# Altium schematic sheet COMS0004_2_TXDevMux.SchDoc: BLUEsat Switching Circuit
size A3; Engineer: D. JEDRYCHOWSKI; Organization: BLUEsat Project; Address1: Room 419; Address2: School of EE&T; Address3: UNSW, NSW 2052; Address4: Australia; DocumentNumber: COMS0004; SheetNumber: 2; SheetTotal: 4; Description: Selects the AFSK and GMSK modems for transmission; Version: 1.0
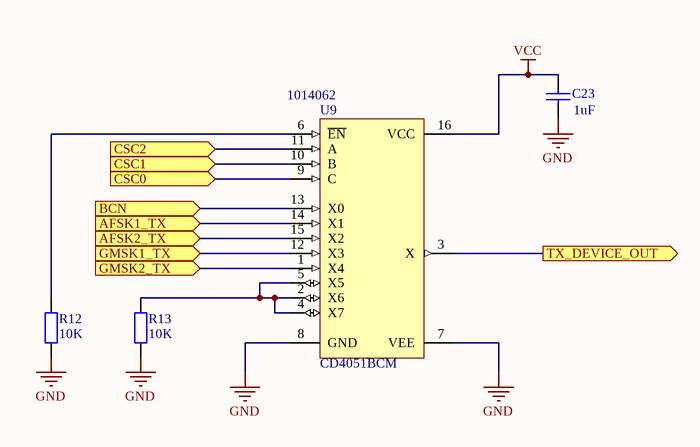
[diagram p0: COMS0004_2_TXDevMux.SchDoc]

## Parts
C23  value 1uF  [0805]  (hidden comment: C1210)
R12  value 10K  [RESC2012N]  (hidden comment: Res1)
R13  value 10K  [RESC2012N]  (hidden comment: Res1)
U9  CD4051BCM  Supplier Part Number 1: 1014062  [M16A_M]

## Ports
AFSK1_TX (in), AFSK2_TX (in), BCN (in), CSC0 (in), CSC1 (in), CSC2 (in), GMSK1_TX (in), GMSK2_TX (in), TX_DEVICE_OUT (out)

## Nets
GND: C23.1 R12.1 R13.1 U9.7(VEE) U9.8(GND)
VCC: C23.2 U9.16(VCC)
AFSK1_TX: U9.14(X1) ; port AFSK1_TX
AFSK2_TX: U9.15(X2) ; port AFSK2_TX
BCN: U9.13(X0) ; port BCN
CSC0: U9.9(C) ; port CSC0
CSC1: U9.10(B) ; port CSC1
CSC2: U9.11(A) ; port CSC2
GMSK1_TX: U9.12(X3) ; port GMSK1_TX
GMSK2_TX: U9.1(X4) ; port GMSK2_TX
TX_DEVICE_OUT: U9.3(X) ; port TX_DEVICE_OUT
NetR12_2: R12.2 U9.6(~{EN})
NetR13_2: R13.2 U9.2(X6) U9.4(X7) U9.5(X5)

## Notes on the sheet
- Title
- Description:
- Size:
- Author:
- Date:
- A3
- Time:
- Version
- Sheet:
- Drawing No.:
- of
- File:

## Library data of the parts
C23 = Cap: Capacitor; Published: 8-Jun-2000; LatestRevisionDate: 17-Jul-2002; LatestRevisionNote: Re-released for DXP Platform.; PackageReference: RAD-0.3; Publisher: Altium Limited; PackageDescription: Radial Cap, Thru-Hole; 2 Leads; 0.3 in Pin Spacing; Supplier 1: Farnell; Supplier Part Number 1: 1637035
R12 R13 = Res2: Resistor; Published: 8-Jun-2000; LatestRevisionDate: 17-Jul-2002; LatestRevisionNote: Re-released for DXP Platform.; PackageReference: AXIAL-0.4; Publisher: Altium Limited; PackageDescription: Axial Device, Thru-Hole; 2 Leads; 0.4 in Pin Spacing; Supplier 1: Farnell; Supplier Part Number 1: 1811779
U9 = CD4051BCM: 8-Channel Analog Multiplexer/Demultiplexer; Published: 17-Jul-2002; LatestRevisionDate: 13-Apr-2006; LatestRevisionNote: IPC-7351 Footprint Added.; DatasheetVersion: Jan-1999; PackageVersion: 2000; PackageReference: M16A; Publisher: Altium Limited; PackageDescription: 16-Pin Small Outline Integrated Circuit 1.27 mm Pitch; ComponentLink1Description: Manufacturer Link; ComponentLink1URL: http://www.fairchildsemi.com/; ComponentLink2Description: Datasheet; ComponentLink2URL: http://www.fairchildsemi.com/ds/CD%2FCD4052BC.pdf; Code_IPC: SOIC127P600-16; Supplier 1: Farnell